# Altium schematic sheet connectors.SchDoc
size A4
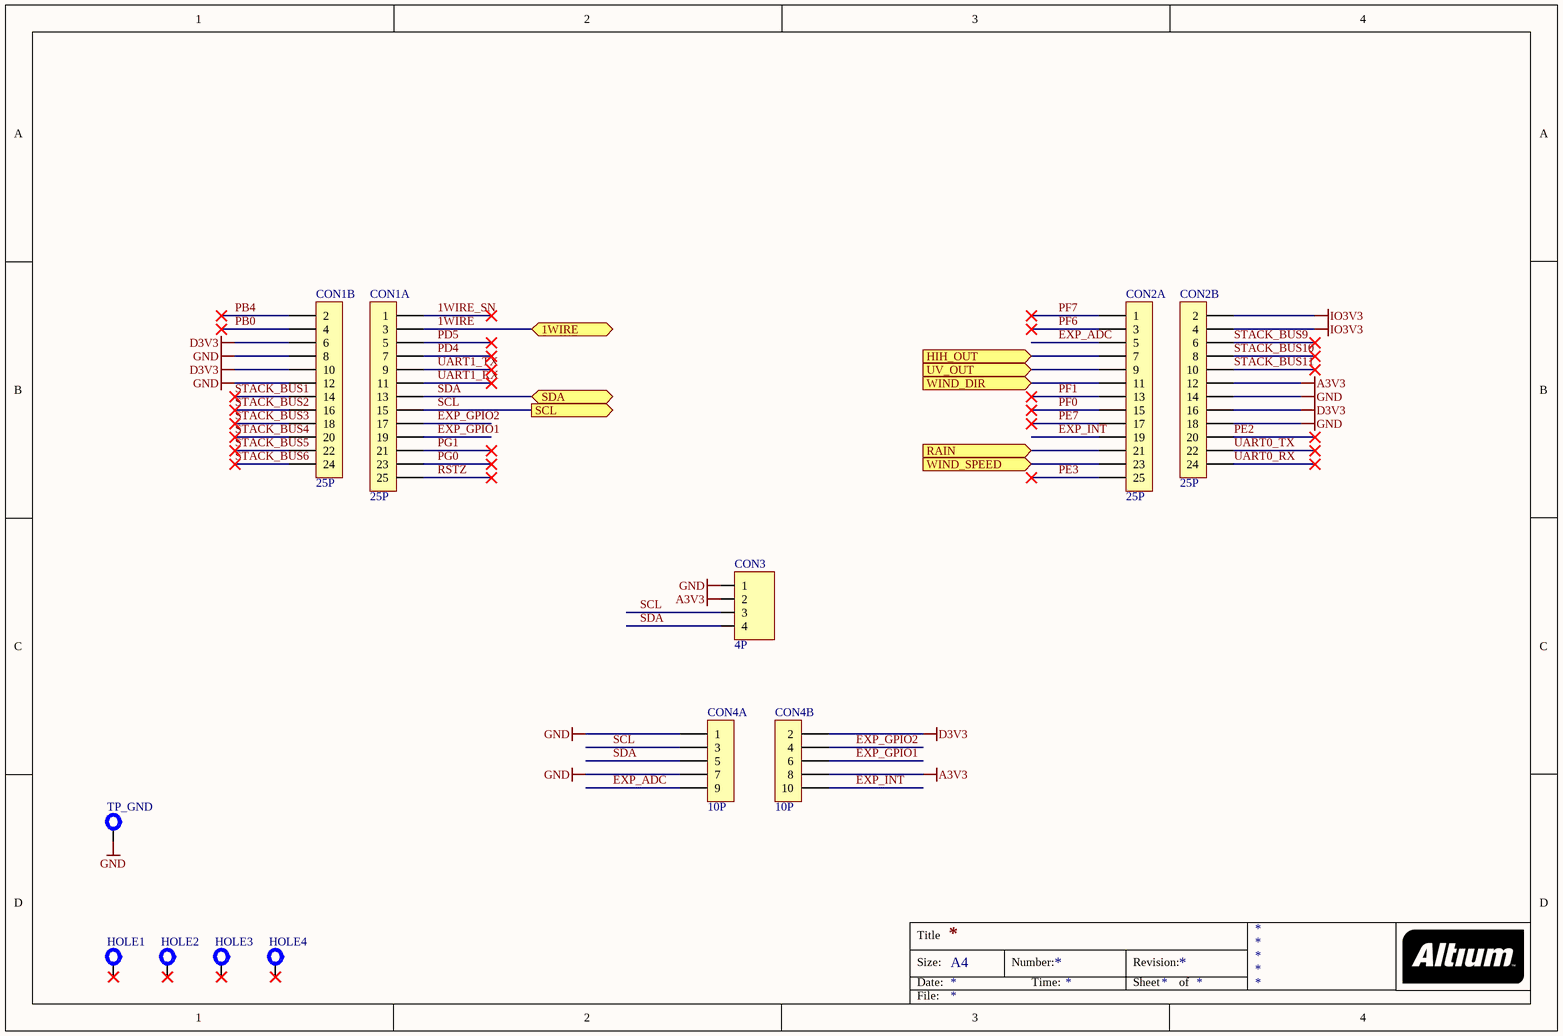
[diagram p0: connectors.SchDoc]

## Parts
CON1  25P  [DF9-25-STACK]  (parts A,B of 2)
CON2  25P  [DF9-25-STACK]  (parts A,B of 2)
CON3  4P  [SIP-4]
CON4  10P  [IDC-10]  (parts A,B of 2)
HOLE1  HOLE  [NPTH-3MM]  (value not drawn)  (no BOM)
HOLE2  HOLE  [NPTH-3MM]  (value not drawn)  (no BOM)
HOLE3  HOLE  [NPTH-3MM]  (value not drawn)  (no BOM)
HOLE4  HOLE  [NPTH-3MM]  (value not drawn)  (no BOM)
TP_GND  Test Point  [TEST-PROBE2]  (value not drawn)  (no BOM)

## Ports
1WIRE (bidir), HIH_OUT (in), RAIN (in), SCL (out), SDA (bidir), UV_OUT (in), WIND_DIR (in), WIND_SPEED (in)

## Nets
A3V3: CON2.12 CON3.2 CON4.8
D3V3: CON1.6 CON1.10 CON2.16 CON4.2
GND: CON1.8 CON1.12 CON2.14 CON2.18 CON3.1 CON4.1 CON4.7 TP_GND.1(TP)
IO3V3: CON2.2 CON2.4
1WIRE: CON1.3 ; port 1WIRE
1WIRE_SN: CON1.1
EXP_ADC: CON2.5 CON4.9
EXP_GPIO1: CON1.19 CON4.6
EXP_GPIO2: CON1.17 CON4.4
EXP_INT: CON2.19 CON4.10
HIH_OUT: CON2.7 ; port HIH_OUT
PB0: CON1.4
PB4: CON1.2
PD4: CON1.7
PD5: CON1.5
PE2: CON2.20
PE3: CON2.25
PE7: CON2.17
PF0: CON2.15
PF1: CON2.13
PF6: CON2.3
PF7: CON2.1
PG0: CON1.23
PG1: CON1.21
RAIN: CON2.21 ; port RAIN
RSTZ: CON1.25
SCL: CON1.15 CON3.3 CON4.3 ; port SCL
SDA: CON1.13 CON3.4 CON4.5 ; port SDA
STACK_BUS1: CON1.14
STACK_BUS2: CON1.16
STACK_BUS3: CON1.18
STACK_BUS4: CON1.20
STACK_BUS5: CON1.22
STACK_BUS6: CON1.24
STACK_BUS9: CON2.6
STACK_BUS10: CON2.8
STACK_BUS11: CON2.10
UART0_RX: CON2.24
UART0_TX: CON2.22
UART1_RX: CON1.11
UART1_TX: CON1.9
UV_OUT: CON2.9 ; port UV_OUT
WIND_DIR: CON2.11 ; port WIND_DIR
WIND_SPEED: CON2.23 ; port WIND_SPEED

Not connected (* = marked no-connect by the designer): HOLE1 1(TP)*; HOLE2 1(TP)*; HOLE3 1(TP)*; HOLE4 1(TP)*

## Notes on the sheet
- Title
- Size:
- Date:
- A4
- Number:
- Time:
- Revision:
- Sheet
- of
- File:

## Library data of the parts
CON1 CON2 = CON25: Connector 25 Pins; Owner: Ricardo Rodrigues; Assembly: INS; Sub-Type: Connector; Creation Date: 2013-01-13; Status: Valid; Validation Date: 2012-01-13; Type: Electrical & Mechanical
CON3 = CON04: Connector 4 pins; Owner: Rui Rebelo; Assembly: INS; Sub-Type: Connector; Creation Date: 2005-10-17; Status: Valid; Validation Date: 2006-05-15; Type: Electrical & Mechanical
CON4 = CON10: Connector 10 Pins; Owner: António Silva; Assembly: INS; Sub-Type: Connector; Creation Date: 2005-11-21; Status: Valid; Validation Date: 2006-05-15; Type: Electrical & Mechanical
HOLE1-HOLE4 = PCB HOLE: PCB Fixation Hole M3; Owner: Nuno Brum; Sub-Type: Mechanical; Type: PCB; Creation Date: 2005-06-01; Status: Valid; Validation Date: 2006-05-15; Assembly: PCB
TP_GND = TEST-PROBE: Test/Probe Point; Owner: Nuno Brum; Sub-Type: Mechanical; Assembly: PCB; Validation Date: 2006-05-15; Type: PCB; Creation Date: 2005-06-01; Status: Valid